# EAGLE schematic kilo (EAGLE 9.3.0)

## Sheet 1 of 5: ESP32
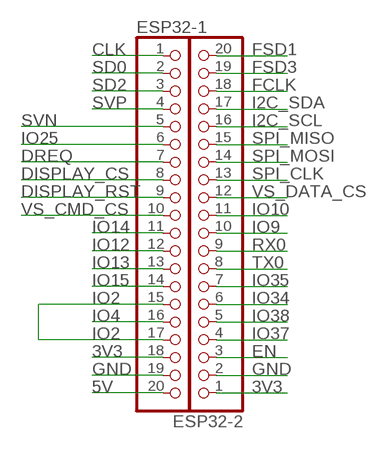
[diagram p0: schematic, sheet 1]

### Parts
ESP32-1  PINHD-1X20  [1X20]
ESP32-2  PINHD-1X20  [1X20]

### Nets
3V3: ESP32-1.18 ESP32-2.1 ; also sheet 2,3,5
5V: ESP32-1.20
CLK: ESP32-1.1
DISPLAY_CS: ESP32-1.8 ; also sheet 3
DISPLAY_RST: ESP32-1.9 ; also sheet 3
DREQ: ESP32-1.7 ; also sheet 2
EN: ESP32-2.3
FCLK: ESP32-2.18
FSD1: ESP32-2.20
FSD3: ESP32-2.19
GND: ESP32-1.19 ESP32-2.2 ; also sheet 2,3,4,5
I2C_SCL: ESP32-2.16
I2C_SDA: ESP32-2.17
IO2: ESP32-1.15 ESP32-1.17 ; also sheet 4
IO4: ESP32-1.16 ; also sheet 4
IO9: ESP32-2.10 ; also sheet 3
IO10: ESP32-2.11 ; also sheet 5
IO12: ESP32-1.12 ; also sheet 4
IO13: ESP32-1.13 ; also sheet 4
IO14: ESP32-1.11 ; also sheet 4
IO15: ESP32-1.14 ; also sheet 4
IO25: ESP32-1.6 ; also sheet 5
IO34: ESP32-2.6
IO35: ESP32-2.7
IO37: ESP32-2.4 ; also sheet 5
IO38: ESP32-2.5 ; also sheet 5
RX0: ESP32-2.9
SD0: ESP32-1.2
SD2: ESP32-1.3
SPI_CLK: ESP32-2.13 ; also sheet 2,3
SPI_MISO: ESP32-2.15 ; also sheet 2,3
SPI_MOSI: ESP32-2.14 ; also sheet 2,3
SVN: ESP32-1.5
SVP: ESP32-1.4 ; also sheet 5
TX0: ESP32-2.8
VS_CMD_CS: ESP32-1.10 ; also sheet 2
VS_DATA_CS: ESP32-2.12 ; also sheet 2

## Sheet 2 of 5: VS1053
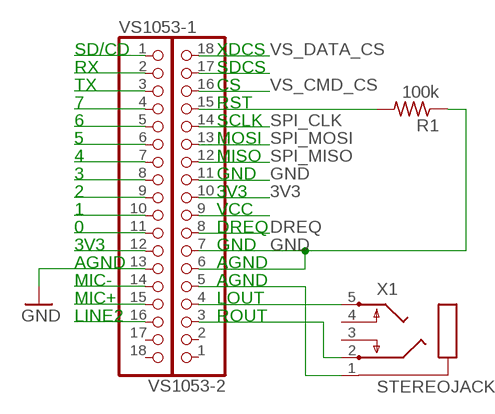
[diagram p1: schematic, sheet 2]

### Parts
R1  100k  R-US_0204/2V  [0204V]
VS1053-1  PINHD-1X18  [1X18]
VS1053-2  PINHD-1X18  [1X18]
X1  STEREOJACK  [STX3100]

### Nets
3V3: VS1053-2.10 ; also sheet 1,3,5
DREQ: VS1053-2.8 ; also sheet 1
GND: R1.1 VS1053-1.13 VS1053-2.6 VS1053-2.7 VS1053-2.11 ; also sheet 1,3,4,5
N$1: VS1053-1.9
N$2: VS1053-1.1
N$3: VS1053-1.2
N$4: VS1053-1.3
N$5: VS1053-1.4
N$6: VS1053-1.5
N$7: VS1053-1.6
N$8: VS1053-1.7
N$9: VS1053-1.8
N$10: VS1053-1.10
N$11: VS1053-1.11
N$12: VS1053-1.12
N$13: VS1053-2.4 X1.5
N$14: VS1053-1.14
N$15: VS1053-1.15
N$16: VS1053-1.16
N$17: VS1053-2.3 X1.2
N$18: VS1053-2.17
N$20: R1.2 VS1053-2.15
N$21: VS1053-2.5 X1.1
N$26: VS1053-2.9
SPI_CLK: VS1053-2.14 ; also sheet 1,3
SPI_MISO: VS1053-2.12 ; also sheet 1,3
SPI_MOSI: VS1053-2.13 ; also sheet 1,3
VS_CMD_CS: VS1053-2.16 ; also sheet 1
VS_DATA_CS: VS1053-2.18 ; also sheet 1
Unconnected: VS1053-1.17 VS1053-1.18 VS1053-2.1 VS1053-2.2 X1.3 X1.4

### Notes on the sheet
- SD/CD | XDCS
- RX | SDCS
- TX | CS
- 7 | RST
- 6 | SCLK
- 5 | MOSI
- 4 | MISO
- 3 | GND
- 2 | 3V3
- 1 | VCC
- 0 | DREQ
- 3V3 | GND
- AGND | AGND
- MIC- | AGND
- MIC+ | LOUT
- LINE2 | ROUT

## Sheet 3 of 5: DISPLAY
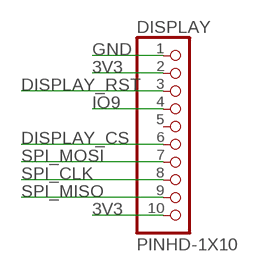
[diagram p2: schematic, sheet 3]

### Parts
DISPLAY  PINHD-1X10  [1X10-BIG]

### Nets
3V3: DISPLAY.2 DISPLAY.10 ; also sheet 1,2,5
DISPLAY_CS: DISPLAY.6 ; also sheet 1
DISPLAY_RST: DISPLAY.3 ; also sheet 1
GND: DISPLAY.1 ; also sheet 1,2,4,5
IO9: DISPLAY.4 ; also sheet 1
SPI_CLK: DISPLAY.8 ; also sheet 1,2
SPI_MISO: DISPLAY.9 ; also sheet 1,2
SPI_MOSI: DISPLAY.7 ; also sheet 1,2
Unconnected: DISPLAY.5

## Sheet 4 of 5: SD CARD
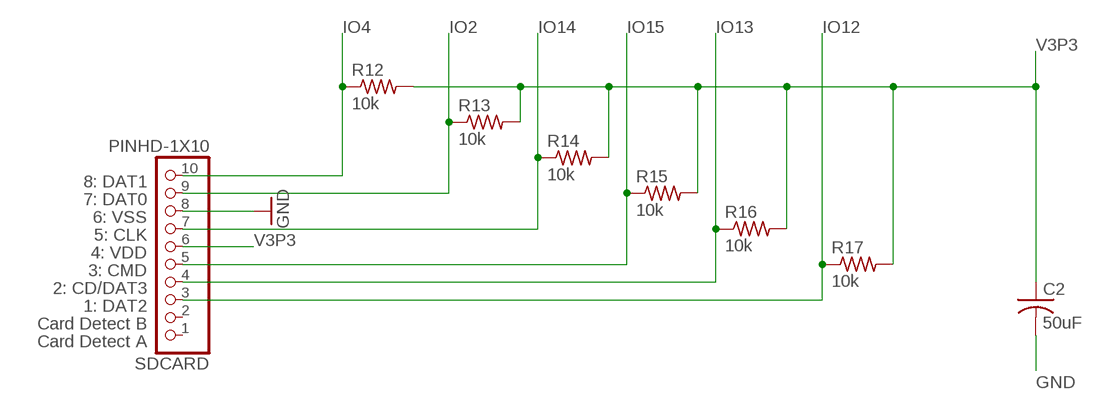
[diagram p3: schematic, sheet 4]

### Parts
C2  50uF  C-US025-024X044  [C025-024X044]
R12  10k  R-US_0204/2V  [0204V]
R13  10k  R-US_0204/2V  [0204V]
R14  10k  R-US_0204/2V  [0204V]
R15  10k  R-US_0204/2V  [0204V]
R16  10k  R-US_0204/2V  [0204V]
R17  10k  R-US_0204/2V  [0204V]
SDCARD  PINHD-1X10  [1X10-BIG]

### Nets
GND: C2.2 SDCARD.8 ; also sheet 1,2,3,5
IO2: R13.1 SDCARD.9 ; also sheet 1
IO4: R12.1 SDCARD.10 ; also sheet 1
IO12: R17.1 SDCARD.3 ; also sheet 1
IO13: R16.1 SDCARD.4 ; also sheet 1
IO14: R14.1 SDCARD.7 ; also sheet 1
IO15: R15.1 SDCARD.5 ; also sheet 1
V3P3: C2.1 R12.2 R13.2 R14.2 R15.2 R16.2 R17.2 SDCARD.6
Unconnected: SDCARD.1 SDCARD.2

### Notes on the sheet
- 8: DAT1
- 7: DAT0
- 6: VSS
- 5: CLK
- 4: VDD
- 3: CMD
- 2: CD/DAT3
- 1: DAT2
- Card Detect B
- Card Detect A

## Sheet 5 of 5: BUTTONS
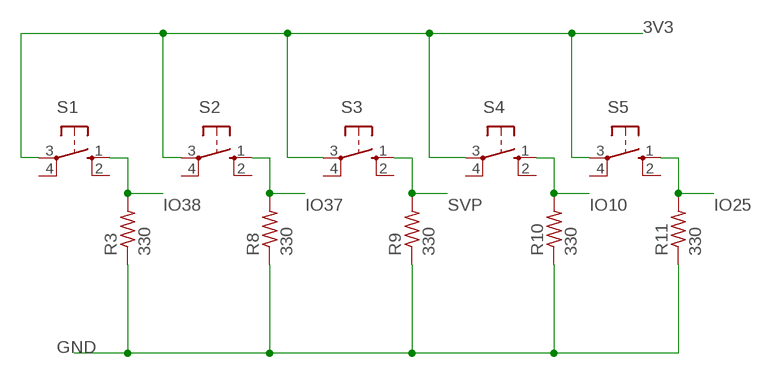
[diagram p4: schematic, sheet 5]

### Parts
R3  330  R-US_0204/2V  [0204V]
R8  330  R-US_0204/2V  [0204V]
R9  330  R-US_0204/2V  [0204V]
R10  330  R-US_0204/2V  [0204V]
R11  330  R-US_0204/2V  [0204V]
S1  10-XX  [B3F-10XX]
S2  10-XX  [B3F-10XX]
S3  10-XX  [B3F-10XX]
S4  10-XX  [B3F-10XX]
S5  10-XX  [B3F-10XX]

### Nets
3V3: S1.3(P) S2.3(P) S3.3(P) S4.3(P) S5.3(P) ; also sheet 1,2,3
GND: R3.1 R8.1 R9.1 R10.1 R11.1 ; also sheet 1,2,3,4
IO10: R10.2 S4.1(S) ; also sheet 1
IO25: R11.2 S5.1(S) ; also sheet 1
IO37: R8.2 S2.1(S) ; also sheet 1
IO38: R3.2 S1.1(S) ; also sheet 1
SVP: R9.2 S3.1(S) ; also sheet 1
Unconnected: S1.2(S1) S1.4(P1) S2.2(S1) S2.4(P1) S3.2(S1) S3.4(P1) S4.2(S1) S4.4(P1) S5.2(S1) S5.4(P1)

## Library data of the parts
C2 = adafruit:C-US: CAPACITOR, American symbol
DISPLAY SDCARD = adafruit:PINHD-1X10: Pin header 1x10 0.1" spacing With round pins
ESP32-1 ESP32-2 = adafruit:PINHD-1X20: PIN HEADER
R1 R3 R8-R17 = adafruit:R-US_: RESISTOR, American symbol
S1-S5 = switch-omron:10-XX: OMRON SWITCH; MPN: B3F-1000; OC_FARNELL: 176432; OC_NEWARK: 36M3542
VS1053-1 VS1053-2 = adafruit:PINHD-1X18: PIN HEADER
X1 = adafruit:STEREOJACK: MIC/HEADPHONE JACK Stereo jack with two switches. Kycon STX3100, CUI SJ1-3555NG and/or 4UCon 05544